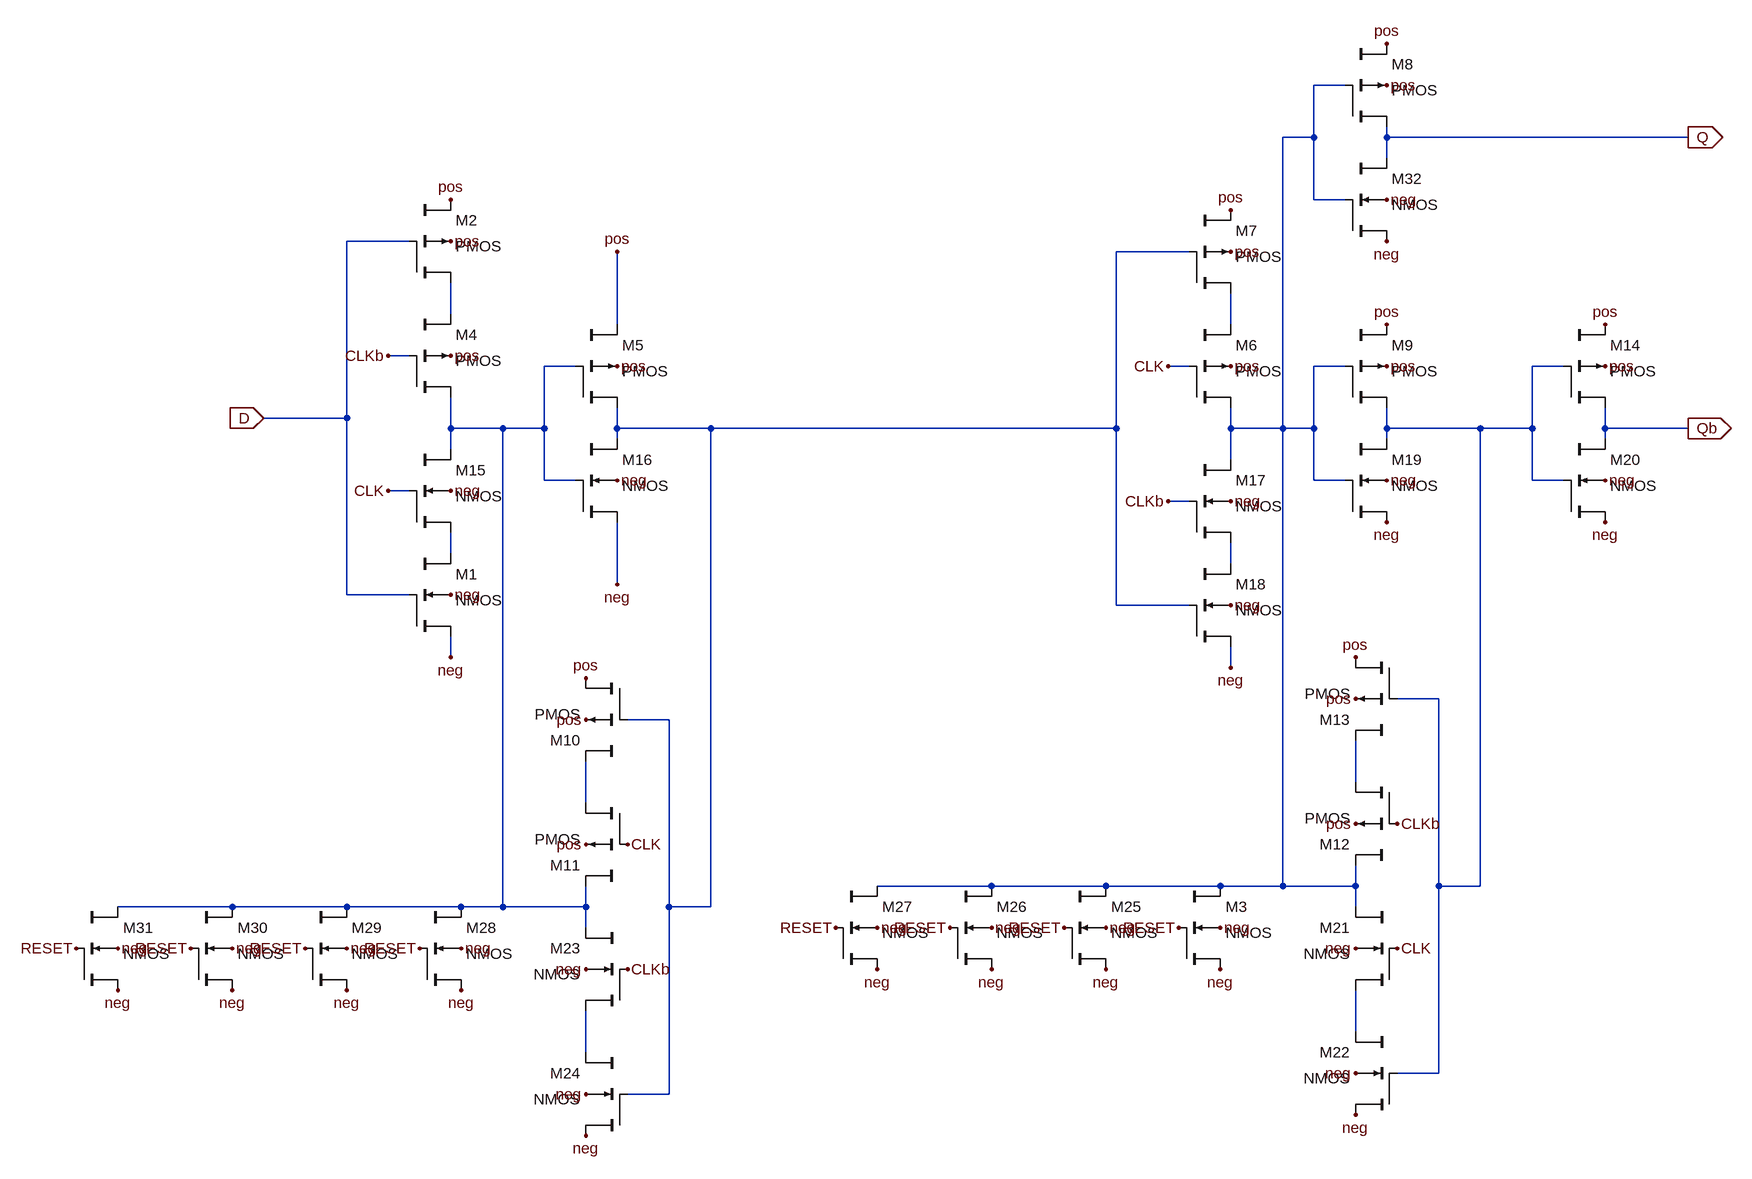
[diagram p0: schematic ResetFlipFlop_High_LDS.asc]
ResetFlipFlop_High_LDS.asc, the LTspice schematic file:
Version 4
SHEET 1 880 680
WIRE -1584 -1648 -1632 -1648
WIRE -1632 -1568 -1632 -1648
WIRE -1632 -1568 -1680 -1568
WIRE -1520 -1568 -1520 -1584
WIRE -1056 -1568 -1520 -1568
WIRE -1520 -1536 -1520 -1568
WIRE -1632 -1472 -1632 -1568
WIRE -1584 -1472 -1632 -1472
WIRE -3024 -1408 -3120 -1408
WIRE -1824 -1392 -1936 -1392
WIRE -2960 -1296 -2960 -1344
WIRE -2704 -1280 -2704 -1392
WIRE -1760 -1280 -1760 -1328
WIRE -3024 -1232 -3056 -1232
WIRE -2768 -1216 -2816 -1216
WIRE -1824 -1216 -1856 -1216
WIRE -1584 -1216 -1632 -1216
WIRE -1248 -1216 -1296 -1216
WIRE -3120 -1136 -3120 -1408
WIRE -3120 -1136 -3248 -1136
WIRE -2960 -1120 -2960 -1168
WIRE -2880 -1120 -2960 -1120
WIRE -2816 -1120 -2816 -1216
WIRE -2816 -1120 -2880 -1120
WIRE -2704 -1120 -2704 -1152
WIRE -2560 -1120 -2704 -1120
WIRE -1936 -1120 -1936 -1392
WIRE -1936 -1120 -2560 -1120
WIRE -1760 -1120 -1760 -1152
WIRE -1680 -1120 -1680 -1568
WIRE -1680 -1120 -1760 -1120
WIRE -1632 -1120 -1632 -1216
WIRE -1632 -1120 -1680 -1120
WIRE -1520 -1120 -1520 -1152
WIRE -1376 -1120 -1520 -1120
WIRE -1296 -1120 -1296 -1216
WIRE -1296 -1120 -1376 -1120
WIRE -1184 -1120 -1184 -1152
WIRE -1056 -1120 -1184 -1120
WIRE -2704 -1104 -2704 -1120
WIRE -1520 -1104 -1520 -1120
WIRE -1184 -1104 -1184 -1120
WIRE -2960 -1088 -2960 -1120
WIRE -1760 -1072 -1760 -1120
WIRE -2816 -1040 -2816 -1120
WIRE -2768 -1040 -2816 -1040
WIRE -1632 -1040 -1632 -1120
WIRE -1584 -1040 -1632 -1040
WIRE -1296 -1040 -1296 -1120
WIRE -1248 -1040 -1296 -1040
WIRE -3024 -1024 -3056 -1024
WIRE -1824 -1008 -1856 -1008
WIRE -2960 -928 -2960 -960
WIRE -1760 -912 -1760 -944
WIRE -2704 -880 -2704 -976
WIRE -3120 -864 -3120 -1136
WIRE -3024 -864 -3120 -864
WIRE -1936 -848 -1936 -1120
WIRE -1824 -848 -1936 -848
WIRE -2960 -768 -2960 -800
WIRE -1760 -752 -1760 -784
WIRE -1440 -704 -1504 -704
WIRE -2624 -672 -2688 -672
WIRE -1568 -576 -1568 -640
WIRE -2752 -544 -2752 -608
WIRE -2128 -416 -2304 -416
WIRE -1952 -416 -2128 -416
WIRE -1776 -416 -1952 -416
WIRE -1680 -416 -1680 -1120
WIRE -1680 -416 -1776 -416
WIRE -1568 -416 -1568 -448
WIRE -1568 -416 -1680 -416
WIRE -1440 -416 -1440 -704
WIRE -1376 -416 -1376 -1120
WIRE -1376 -416 -1440 -416
WIRE -3296 -384 -3472 -384
WIRE -3120 -384 -3296 -384
WIRE -2944 -384 -3120 -384
WIRE -2880 -384 -2880 -1120
WIRE -2880 -384 -2944 -384
WIRE -2752 -384 -2752 -416
WIRE -2752 -384 -2880 -384
WIRE -2624 -384 -2624 -672
WIRE -2560 -384 -2560 -1120
WIRE -2560 -384 -2624 -384
WIRE -1568 -384 -1568 -416
WIRE -2752 -352 -2752 -384
WIRE -1568 -192 -1568 -256
WIRE -2752 -160 -2752 -224
WIRE -1440 -128 -1440 -416
WIRE -1440 -128 -1504 -128
WIRE -2624 -96 -2624 -384
WIRE -2624 -96 -2688 -96
FLAG -2960 -1472 pos
FLAG -3248 -1136 D
IOPIN -3248 -1136 In
FLAG -3056 -1232 CLKb
FLAG -3056 -1024 CLK
FLAG -2960 -1232 pos
FLAG -2960 -1408 pos
FLAG -2960 -1024 neg
FLAG -2960 -864 neg
FLAG -2960 -768 neg
FLAG -2704 -1392 pos
FLAG -2704 -1216 pos
FLAG -2704 -1040 neg
FLAG -2704 -880 neg
FLAG -1760 -1456 pos
FLAG -1760 -1216 pos
FLAG -1760 -1392 pos
FLAG -1760 -1008 neg
FLAG -1760 -848 neg
FLAG -1760 -752 neg
FLAG -2752 -736 pos
FLAG -2752 -672 pos
FLAG -2752 -480 pos
FLAG -2752 -32 neg
FLAG -2752 -96 neg
FLAG -2752 -288 neg
FLAG -1520 -1216 pos
FLAG -1520 -1040 neg
FLAG -1568 -768 pos
FLAG -1568 -704 pos
FLAG -1568 -512 pos
FLAG -1568 -64 neg
FLAG -1568 -128 neg
FLAG -1568 -320 neg
FLAG -1520 -976 neg
FLAG -1520 -1280 pos
FLAG -1184 -1216 pos
FLAG -1184 -1040 neg
FLAG -1184 -976 neg
FLAG -1184 -1280 pos
FLAG -1056 -1120 Qb
IOPIN -1056 -1120 Out
FLAG -1056 -1568 Q
IOPIN -1056 -1568 Out
FLAG -1856 -1216 CLK
FLAG -1856 -1008 CLKb
FLAG -2688 -480 CLK
FLAG -2688 -288 CLKb
FLAG -1504 -512 CLKb
FLAG -1504 -320 CLK
FLAG -1520 -1648 pos
FLAG -1520 -1472 neg
FLAG -1520 -1408 neg
FLAG -1520 -1712 pos
FLAG -1840 -352 RESET
FLAG -1776 -352 neg
FLAG -1776 -288 neg
FLAG -2016 -352 RESET
FLAG -1952 -352 neg
FLAG -1952 -288 neg
FLAG -2192 -352 RESET
FLAG -2128 -352 neg
FLAG -2128 -288 neg
FLAG -2368 -352 RESET
FLAG -2304 -352 neg
FLAG -2304 -288 neg
FLAG -3008 -320 RESET
FLAG -2944 -320 neg
FLAG -2944 -256 neg
FLAG -3184 -320 RESET
FLAG -3120 -320 neg
FLAG -3120 -256 neg
FLAG -3360 -320 RESET
FLAG -3296 -320 neg
FLAG -3296 -256 neg
FLAG -3536 -320 RESET
FLAG -3472 -320 neg
FLAG -3472 -256 neg
SYMBOL cktsym\\nmos4 -2960 -864 R0
SYMATTR InstName M1
SYMATTR Value2 l=0.9u w=3u
SYMBOL cktsym\\pmos4 -2960 -1408 R0
SYMATTR InstName M2
SYMATTR Value2 l=0.9u w=6u
SYMBOL cktsym\\nmos4 -1776 -352 R0
SYMATTR InstName M3
SYMATTR Value2 l=0.9u w=4.5u
SYMBOL cktsym\\pmos4 -2960 -1232 R0
SYMATTR InstName M4
SYMATTR Value2 l=0.9u w=6u
SYMBOL cktsym\\pmos4 -2704 -1216 R0
SYMATTR InstName M5
SYMATTR Value2 l=0.9u w=6u
SYMBOL cktsym\\pmos4 -1760 -1216 R0
SYMATTR InstName M6
SYMATTR Value2 l=0.9u w=6u
SYMBOL cktsym\\pmos4 -1760 -1392 R0
SYMATTR InstName M7
SYMATTR Value2 l=0.9u w=6u
SYMBOL cktsym\\pmos4 -1520 -1648 R0
SYMATTR InstName M8
SYMATTR Value2 l=0.9u w=6u
SYMBOL cktsym\\pmos4 -1520 -1216 R0
SYMATTR InstName M9
SYMATTR Value2 l=0.9u w=6u
SYMBOL cktsym\\pmos4 -2752 -672 R180
SYMATTR InstName M10
SYMATTR Value2 l=0.9u w=6u
SYMBOL cktsym\\pmos4 -2752 -480 R180
SYMATTR InstName M11
SYMATTR Value2 l=0.9u w=6u
SYMBOL cktsym\\pmos4 -1568 -512 R180
SYMATTR InstName M12
SYMATTR Value2 l=0.9u w=6u
SYMBOL cktsym\\pmos4 -1568 -704 R180
SYMATTR InstName M13
SYMATTR Value2 l=0.9u w=6u
SYMBOL cktsym\\pmos4 -1184 -1216 R0
SYMATTR InstName M14
SYMATTR Value2 l=0.9u w=6u
SYMBOL cktsym\\nmos4 -2960 -1024 R0
SYMATTR InstName M15
SYMATTR Value2 l=0.9u w=3u
SYMBOL cktsym\\nmos4 -2704 -1040 R0
SYMATTR InstName M16
SYMATTR Value2 l=0.9u w=3u
SYMBOL cktsym\\nmos4 -1760 -1008 R0
SYMATTR InstName M17
SYMATTR Value2 l=0.9u w=3u
SYMBOL cktsym\\nmos4 -1760 -848 R0
SYMATTR InstName M18
SYMATTR Value2 l=0.9u w=3u
SYMBOL cktsym\\nmos4 -1520 -1040 R0
SYMATTR InstName M19
SYMATTR Value2 l=0.9u w=3u
SYMBOL cktsym\\nmos4 -1184 -1040 R0
SYMATTR InstName M20
SYMATTR Value2 l=0.9u w=3u
SYMBOL cktsym\\nmos4 -1568 -320 M0
SYMATTR InstName M21
SYMATTR Value2 l=0.9u w=3u
SYMBOL cktsym\\nmos4 -1568 -128 M0
SYMATTR InstName M22
SYMATTR Value2 l=0.9u w=3u
SYMBOL cktsym\\nmos4 -2752 -288 M0
SYMATTR InstName M23
SYMATTR Value2 l=0.9u w=3u
SYMBOL cktsym\\nmos4 -2752 -96 M0
SYMATTR InstName M24
SYMATTR Value2 l=0.9u w=3u
SYMBOL cktsym\\nmos4 -1952 -352 R0
SYMATTR InstName M25
SYMATTR Value2 l=0.9u w=4.5u
SYMBOL cktsym\\nmos4 -2128 -352 R0
SYMATTR InstName M26
SYMATTR Value2 l=0.9u w=4.5u
SYMBOL cktsym\\nmos4 -2304 -352 R0
SYMATTR InstName M27
SYMATTR Value2 l=0.9u w=4.5u
SYMBOL cktsym\\nmos4 -2944 -320 R0
SYMATTR InstName M28
SYMATTR Value2 l=0.9u w=4.5u
SYMBOL cktsym\\nmos4 -3120 -320 R0
SYMATTR InstName M29
SYMATTR Value2 l=0.9u w=4.5u
SYMBOL cktsym\\nmos4 -3296 -320 R0
SYMATTR InstName M30
SYMATTR Value2 l=0.9u w=4.5u
SYMBOL cktsym\\nmos4 -3472 -320 R0
SYMATTR InstName M31
SYMATTR Value2 l=0.9u w=4.5u
SYMBOL cktsym\\nmos4 -1520 -1472 R0
SYMATTR InstName M32
SYMATTR Value2 l=0.9u w=3u

The netlist it stands for:
* ResetFlipFlop_High_LDS.asc
M1 N007 D neg neg NMOS l=0.9u w=3u
M2 N003 D pos pos PMOS l=0.9u w=6u
M3 N001 RESET neg neg NMOS l=0.9u w=4.5u
M4 N005 CLKb N003 pos PMOS l=0.9u w=6u
M5 N002 N005 pos pos PMOS l=0.9u w=6u
M6 N001 CLK N004 pos PMOS l=0.9u w=6u
M7 N004 N002 pos pos PMOS l=0.9u w=6u
M8 Q N001 pos pos PMOS l=0.9u w=6u
M9 N006 N001 pos pos PMOS l=0.9u w=6u
M10 pos N002 N010 pos PMOS l=0.9u w=6u
M11 N010 CLK N005 pos PMOS l=0.9u w=6u
M12 N009 CLKb N001 pos PMOS l=0.9u w=6u
M13 pos N006 N009 pos PMOS l=0.9u w=6u
M14 Qb N006 pos pos PMOS l=0.9u w=6u
M15 N005 CLK N007 neg NMOS l=0.9u w=3u
M16 N002 N005 neg neg NMOS l=0.9u w=3u
M17 N001 CLKb N008 neg NMOS l=0.9u w=3u
M18 N008 N002 neg neg NMOS l=0.9u w=3u
M19 N006 N001 neg neg NMOS l=0.9u w=3u
M20 Qb N006 neg neg NMOS l=0.9u w=3u
M21 N001 CLK N011 neg NMOS l=0.9u w=3u
M22 N011 N006 neg neg NMOS l=0.9u w=3u
M23 N005 CLKb N012 neg NMOS l=0.9u w=3u
M24 N012 N002 neg neg NMOS l=0.9u w=3u
M25 N001 RESET neg neg NMOS l=0.9u w=4.5u
M26 N001 RESET neg neg NMOS l=0.9u w=4.5u
M27 N001 RESET neg neg NMOS l=0.9u w=4.5u
M28 N005 RESET neg neg NMOS l=0.9u w=4.5u
M29 N005 RESET neg neg NMOS l=0.9u w=4.5u
M30 N005 RESET neg neg NMOS l=0.9u w=4.5u
M31 N005 RESET neg neg NMOS l=0.9u w=4.5u
M32 Q N001 neg neg NMOS l=0.9u w=3u
.model NMOS NMOS
.model PMOS PMOS
.lib standard.mos
.backanno
.end